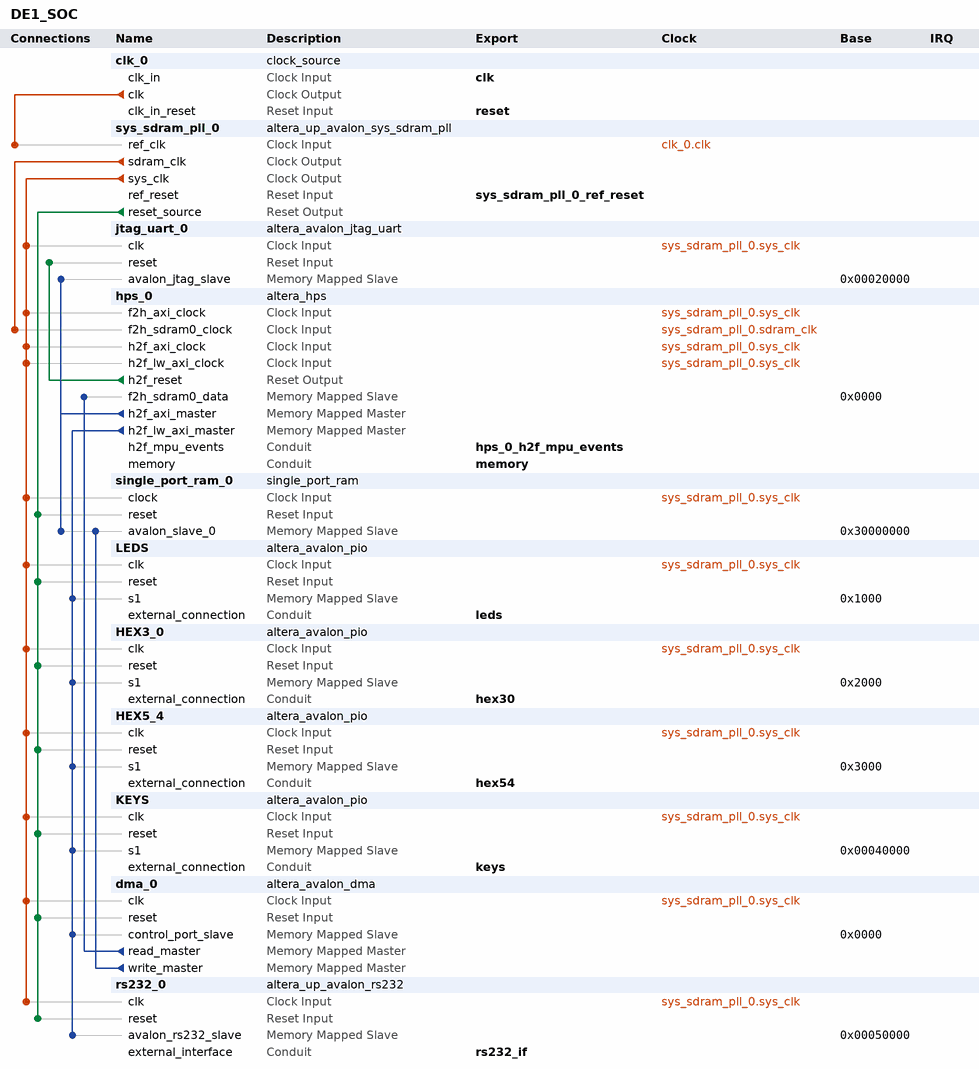
[diagram p0: system contents]
# Platform Designer (Qsys) system DE1_SOC, Cyclone V 5CSEMA5F31C6
# Parameters at their usual value, and those the tool derives, are not listed.
package require -exact qsys 18.1
create_system DE1_SOC
set_project_property DEVICE_FAMILY {Cyclone V}
set_project_property DEVICE 5CSEMA5F31C6

add_instance clk_0 clock_source 18.1
set_instance_parameter_value clk_0 clockFrequency 50000000

add_instance sys_sdram_pll_0 altera_up_avalon_sys_sdram_pll 18.0
set_instance_parameter_value sys_sdram_pll_0 CV_boards DE1-SoC
set_instance_parameter_value sys_sdram_pll_0 gui_outclk 50.0
set_instance_parameter_value sys_sdram_pll_0 gui_refclk 50.0

add_instance jtag_uart_0 altera_avalon_jtag_uart 18.1
set_instance_parameter_value jtag_uart_0 simInteractiveOptions NO_INTERACTIVE_WINDOWS

add_instance hps_0 altera_hps 18.1
set_instance_parameter_value hps_0 EMAC1_Mode N/A
set_instance_parameter_value hps_0 EMAC1_PinMuxing Unused
set_instance_parameter_value hps_0 F2SCLK_COLDRST_Enable false
set_instance_parameter_value hps_0 F2SCLK_DBGRST_Enable false
set_instance_parameter_value hps_0 F2SCLK_WARMRST_Enable false
set_instance_parameter_value hps_0 F2SDRAM_Type AXI-3
set_instance_parameter_value hps_0 F2SDRAM_Width 64
set_instance_parameter_value hps_0 F2SINTERRUPT_Enable false
set_instance_parameter_value hps_0 F2S_Width 2
set_instance_parameter_value hps_0 FPGA_PERIPHERAL_OUTPUT_CLOCK_FREQ_EMAC0_GTX_CLK 125
set_instance_parameter_value hps_0 FPGA_PERIPHERAL_OUTPUT_CLOCK_FREQ_EMAC0_MD_CLK 2.5
set_instance_parameter_value hps_0 FPGA_PERIPHERAL_OUTPUT_CLOCK_FREQ_EMAC1_GTX_CLK 125
set_instance_parameter_value hps_0 FPGA_PERIPHERAL_OUTPUT_CLOCK_FREQ_EMAC1_MD_CLK 2.5
set_instance_parameter_value hps_0 HPS_PROTOCOL DDR3
set_instance_parameter_value hps_0 I2C0_Mode N/A
set_instance_parameter_value hps_0 I2C0_PinMuxing Unused
set_instance_parameter_value hps_0 I2C1_Mode N/A
set_instance_parameter_value hps_0 I2C1_PinMuxing Unused
set_instance_parameter_value hps_0 LWH2F_Enable true
set_instance_parameter_value hps_0 MEM_BANKADDR_WIDTH 3
set_instance_parameter_value hps_0 MEM_CLK_FREQ 300.0
set_instance_parameter_value hps_0 MEM_CLK_FREQ_MAX 533.333
set_instance_parameter_value hps_0 MEM_COL_ADDR_WIDTH 10
set_instance_parameter_value hps_0 MEM_DQ_WIDTH 8
set_instance_parameter_value hps_0 MEM_DRV_STR RZQ/6
set_instance_parameter_value hps_0 MEM_ROW_ADDR_WIDTH 13
set_instance_parameter_value hps_0 MEM_RTT_NOM {ODT Disabled}
set_instance_parameter_value hps_0 MEM_RTT_WR {Dynamic ODT off}
set_instance_parameter_value hps_0 MEM_TCL 7
set_instance_parameter_value hps_0 MEM_TFAW_NS 37.5
set_instance_parameter_value hps_0 MEM_TRAS_NS 37.5
set_instance_parameter_value hps_0 MEM_TRCD_NS 13.125
set_instance_parameter_value hps_0 MEM_TRFC_NS 90.0
set_instance_parameter_value hps_0 MEM_TRP_NS 13.125
set_instance_parameter_value hps_0 MEM_TRRD_NS 13.2
set_instance_parameter_value hps_0 MEM_TRTP_NS 13.2
set_instance_parameter_value hps_0 MEM_VENDOR JEDEC
set_instance_parameter_value hps_0 MEM_WTCL 6
set_instance_parameter_value hps_0 MPU_EVENTS_Enable true
set_instance_parameter_value hps_0 QSPI_Mode N/A
set_instance_parameter_value hps_0 QSPI_PinMuxing Unused
set_instance_parameter_value hps_0 REF_CLK_FREQ 125.0
set_instance_parameter_value hps_0 S2FCLK_USER2CLK 5
set_instance_parameter_value hps_0 S2F_Width 2
set_instance_parameter_value hps_0 SDIO_Mode N/A
set_instance_parameter_value hps_0 SDIO_PinMuxing Unused
set_instance_parameter_value hps_0 SPIM1_Mode N/A
set_instance_parameter_value hps_0 SPIM1_PinMuxing Unused
set_instance_parameter_value hps_0 STM_Enable false
set_instance_parameter_value hps_0 TIMING_BOARD_AC_SKEW 0.02
set_instance_parameter_value hps_0 TIMING_BOARD_AC_TO_CK_SKEW 0.0
set_instance_parameter_value hps_0 TIMING_BOARD_DQ_TO_DQS_SKEW 0.0
set_instance_parameter_value hps_0 TIMING_BOARD_MAX_CK_DELAY 0.6
set_instance_parameter_value hps_0 TIMING_BOARD_MAX_DQS_DELAY 0.6
set_instance_parameter_value hps_0 TIMING_BOARD_SKEW_BETWEEN_DQS 0.02
set_instance_parameter_value hps_0 TIMING_BOARD_SKEW_CKDQS_DIMM_MAX 0.01
set_instance_parameter_value hps_0 TIMING_BOARD_SKEW_CKDQS_DIMM_MIN -0.01
set_instance_parameter_value hps_0 TIMING_BOARD_SKEW_WITHIN_DQS 0.02
set_instance_parameter_value hps_0 TIMING_TDH 100
set_instance_parameter_value hps_0 TIMING_TDQSCK 400
set_instance_parameter_value hps_0 TIMING_TDQSQ 150
set_instance_parameter_value hps_0 TIMING_TDS 25
set_instance_parameter_value hps_0 TIMING_TIH 200
set_instance_parameter_value hps_0 TIMING_TIS 125
set_instance_parameter_value hps_0 TIMING_TQSH 0.38
set_instance_parameter_value hps_0 UART0_Mode N/A
set_instance_parameter_value hps_0 UART0_PinMuxing Unused
set_instance_parameter_value hps_0 USB1_Mode N/A
set_instance_parameter_value hps_0 USB1_PinMuxing Unused
set_instance_parameter_value hps_0 desired_cfg_clk_mhz 100.0
set_instance_parameter_value hps_0 desired_qspi_clk_mhz 400.0

add_instance single_port_ram_0 single_port_ram 1.0
set_instance_parameter_value single_port_ram_0 ADDR_WIDTH 4
set_instance_parameter_value single_port_ram_0 DATA_WIDTH 32
set_instance_parameter_value single_port_ram_0 DMA_ADDR_WIDTH 24

add_instance LEDS altera_avalon_pio 18.1
set_instance_parameter_value LEDS direction Output
set_instance_parameter_value LEDS width 10

add_instance HEX3_0 altera_avalon_pio 18.1
set_instance_parameter_value HEX3_0 direction Output
set_instance_parameter_value HEX3_0 width 32

add_instance HEX5_4 altera_avalon_pio 18.1
set_instance_parameter_value HEX5_4 direction Output
set_instance_parameter_value HEX5_4 width 16

add_instance KEYS altera_avalon_pio 18.1
set_instance_parameter_value KEYS direction Input
set_instance_parameter_value KEYS width 4

add_instance dma_0 altera_avalon_dma 18.1
set_instance_parameter_value dma_0 allowByteTransactions true
set_instance_parameter_value dma_0 allowDoubleWordTransactions true
set_instance_parameter_value dma_0 allowHalfWordTransactions true
set_instance_parameter_value dma_0 allowQuadWordTransactions true
set_instance_parameter_value dma_0 burstEnable true
set_instance_parameter_value dma_0 fifoDepth 64
set_instance_parameter_value dma_0 maxBurstSize 8
set_instance_parameter_value dma_0 minimumDmaTransactionRegisterWidth 13

add_instance rs232_0 altera_up_avalon_rs232 17.1
set_instance_parameter_value rs232_0 baud 115200
set_instance_parameter_value rs232_0 parity None

# connections
add_connection clk_0.clk sys_sdram_pll_0.ref_clk clock
add_connection sys_sdram_pll_0.sdram_clk hps_0.f2h_sdram0_clock clock
add_connection sys_sdram_pll_0.sys_clk dma_0.clk clock
add_connection sys_sdram_pll_0.sys_clk HEX3_0.clk clock
add_connection sys_sdram_pll_0.sys_clk HEX5_4.clk clock
add_connection sys_sdram_pll_0.sys_clk hps_0.f2h_axi_clock clock
add_connection sys_sdram_pll_0.sys_clk hps_0.h2f_axi_clock clock
add_connection sys_sdram_pll_0.sys_clk hps_0.h2f_lw_axi_clock clock
add_connection sys_sdram_pll_0.sys_clk jtag_uart_0.clk clock
add_connection sys_sdram_pll_0.sys_clk KEYS.clk clock
add_connection sys_sdram_pll_0.sys_clk LEDS.clk clock
add_connection sys_sdram_pll_0.sys_clk rs232_0.clk clock
add_connection sys_sdram_pll_0.sys_clk single_port_ram_0.clock clock
add_connection hps_0.h2f_reset jtag_uart_0.reset reset
add_connection sys_sdram_pll_0.reset_source dma_0.reset reset
add_connection sys_sdram_pll_0.reset_source HEX3_0.reset reset
add_connection sys_sdram_pll_0.reset_source HEX5_4.reset reset
add_connection sys_sdram_pll_0.reset_source KEYS.reset reset
add_connection sys_sdram_pll_0.reset_source LEDS.reset reset
add_connection sys_sdram_pll_0.reset_source rs232_0.reset reset
add_connection sys_sdram_pll_0.reset_source single_port_ram_0.reset reset
add_connection dma_0.read_master hps_0.f2h_sdram0_data avalon
set_connection_parameter_value dma_0.read_master/hps_0.f2h_sdram0_data baseAddress 0x0000
add_connection dma_0.write_master single_port_ram_0.avalon_slave_0 avalon
set_connection_parameter_value dma_0.write_master/single_port_ram_0.avalon_slave_0 baseAddress 0x30000000
add_connection hps_0.h2f_axi_master jtag_uart_0.avalon_jtag_slave avalon
set_connection_parameter_value hps_0.h2f_axi_master/jtag_uart_0.avalon_jtag_slave baseAddress 0x00020000
add_connection hps_0.h2f_axi_master single_port_ram_0.avalon_slave_0 avalon
set_connection_parameter_value hps_0.h2f_axi_master/single_port_ram_0.avalon_slave_0 baseAddress 0x30000000
add_connection hps_0.h2f_lw_axi_master dma_0.control_port_slave avalon
set_connection_parameter_value hps_0.h2f_lw_axi_master/dma_0.control_port_slave baseAddress 0x0000
add_connection hps_0.h2f_lw_axi_master HEX3_0.s1 avalon
set_connection_parameter_value hps_0.h2f_lw_axi_master/HEX3_0.s1 baseAddress 0x2000
add_connection hps_0.h2f_lw_axi_master HEX5_4.s1 avalon
set_connection_parameter_value hps_0.h2f_lw_axi_master/HEX5_4.s1 baseAddress 0x3000
add_connection hps_0.h2f_lw_axi_master KEYS.s1 avalon
set_connection_parameter_value hps_0.h2f_lw_axi_master/KEYS.s1 baseAddress 0x00040000
add_connection hps_0.h2f_lw_axi_master LEDS.s1 avalon
set_connection_parameter_value hps_0.h2f_lw_axi_master/LEDS.s1 baseAddress 0x1000
add_connection hps_0.h2f_lw_axi_master rs232_0.avalon_rs232_slave avalon
set_connection_parameter_value hps_0.h2f_lw_axi_master/rs232_0.avalon_rs232_slave baseAddress 0x00050000

# exported interfaces
add_interface clk clock sink
set_interface_property clk EXPORT_OF clk_0.clk_in
add_interface hex30 conduit end
set_interface_property hex30 EXPORT_OF HEX3_0.external_connection
add_interface hex54 conduit end
set_interface_property hex54 EXPORT_OF HEX5_4.external_connection
add_interface hps_0_h2f_mpu_events conduit end
set_interface_property hps_0_h2f_mpu_events EXPORT_OF hps_0.h2f_mpu_events
add_interface keys conduit end
set_interface_property keys EXPORT_OF KEYS.external_connection
add_interface leds conduit end
set_interface_property leds EXPORT_OF LEDS.external_connection
add_interface memory conduit end
set_interface_property memory EXPORT_OF hps_0.memory
add_interface reset reset sink
set_interface_property reset EXPORT_OF clk_0.clk_in_reset
add_interface rs232_if conduit end
set_interface_property rs232_if EXPORT_OF rs232_0.external_interface
add_interface sys_sdram_pll_0_ref_reset reset sink
set_interface_property sys_sdram_pll_0_ref_reset EXPORT_OF sys_sdram_pll_0.ref_reset

set_interconnect_requirement {$system} qsys_mm.clockCrossingAdapter HANDSHAKE
set_interconnect_requirement {$system} qsys_mm.enableEccProtection FALSE
set_interconnect_requirement {$system} qsys_mm.insertDefaultSlave FALSE
set_interconnect_requirement {$system} qsys_mm.maxAdditionalLatency 1

save_system DE1_SOC.qsys
